# Altium schematic sheet Alarm_Clock_Schematic.SchDoc: Alarm Clock with Tempurature
size A; Engineer: Nathan Drzadinski; DocumentNumber: 1; Revision: 3; SheetNumber: 1; SheetTotal: 1
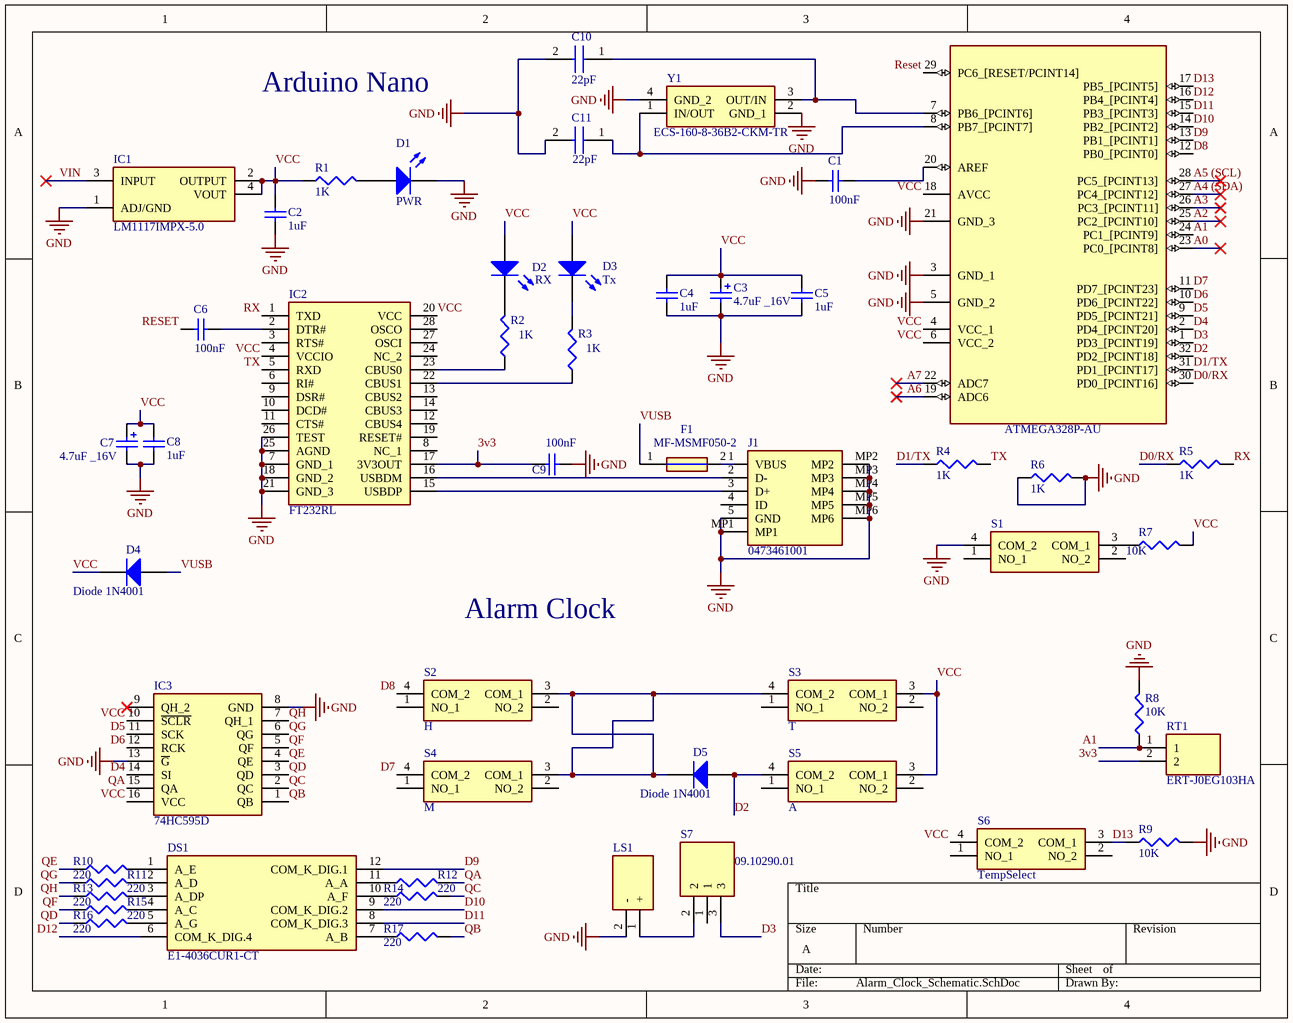
[diagram p0: Alarm_Clock_Schematic.SchDoc]

## Parts
?  ATMEGA328P-AU  [QFP80P900X900X120-32N]
C1  value 100nF  [C0805]  (hidden comment: Cap)
C2  value 1uF  [C0805]  (hidden comment: Cap)
C3  4.7uF _16V  [C1206]
C4  value 1uF  [C0805]  (hidden comment: Cap)
C5  value 1uF  [C0805]  (hidden comment: Cap)
C6  value 100nF  [C0805]  (hidden comment: Cap)
C7  4.7uF _16V  [C1206]
C8  value 1uF  [C0805]  (hidden comment: Cap)
C9  value 100nF  [C1206]
C10  22pF  [CAPC1608X97N]
C11  22pF  [CAPC1608X97N]
D1  PWR  [LED-1]
D2  RX  [LED-1]
D3  Tx  [LED-1]
D4  Diode 1N4001  [DO-41]
D5  Diode 1N4001  [DO-41]
DS1  E1-4036CUR1-CT  [DIPS1016W51P254L3000H745Q12N]
F1  MF-MSMF050-2  [FUSC4632X85N]
IC1  LM1117IMPX-5.0  [SOT230P700X180-4N]
IC2  FT232RL  [SOP65P778X200-28N]
IC3  74HC595D  [SOIC127P600X175-16N]
J1  0473461001  [0473461001]
LS1  (no value)  [25415210ROX]
R1  value 1K  [J1-0603]
R2  value 1K  [J1-0603]
R3  value 1K  [J1-0603]
R4  value 1K  [J1-0603]
R5  value 1K  [J1-0603]
R6  value 1K  [J1-0603]
R7  value 10K  [J1-0603]
R8  value 10K  [J1-0603]
R9  value 10K  [J1-0603]
R10  value 220  [J1-0603]
R11  value 220  [J1-0603]
R12  value 220  [J1-0603]
R13  value 220  [J1-0603]
R14  value 220  [J1-0603]
R15  value 220  [J1-0603]
R16  value 220  [J1-0603]
R17  value 220  [J1-0603]
RT1  ERT-J0EG103HA  [AXIAL-0.3]
S1  (no value)  [12411602]
S2  H  [12411602]
S3  T  [12411602]
S4  M  [12411602]
S5  A  [12411602]
S6  TempSelect  [12411602]
S7  09.10290.01  [091029001]
Y1  ECS-160-8-36B2-CKM-TR  [ECS160836B2CKMTR]

## Nets
GND: ?.3(GND_1) ?.5(GND_2) ?.21(GND_3) C1.1 C2.1 C3.2 C4.1 C5.1 C7.2 C8.1 C9.2 C10.2 C11.2 D1.2(K) IC1.1(ADJ/GND) IC2.7(GND_1) IC2.18(GND_2) IC2.21(GND_3) IC2.25(AGND) IC2.26(TEST) IC3.8(GND) IC3.13(~{G}) J1.5(GND) J1.MP1 J1.MP2 J1.MP3 J1.MP4 J1.MP5 J1.MP6 LS1.2(-) R6.1 R6.2 R8.2 R9.2 S1.4(COM_2) Y1.2(GND_1) Y1.4(GND_2)
3v3: C9.1 IC2.17(3V3OUT) RT1.2
A0: ?.23(PC0_[PCINT8])
A1: ?.24(PC1_[PCINT9]) R8.1 RT1.1
A2: ?.25(PC2_[PCINT10])
A3: ?.26(PC3_[PCINT11])
A4 (SDA): ?.27(PC4_[PCINT12])
A5 (SCL): ?.28(PC5_[PCINT13])
A6: ?.19(ADC6)
A7: ?.22(ADC7)
D0/RX: ?.30(PD0_[PCINT16]) R5.1
D1/TX: ?.31(PD1_[PCINT17]) R4.1
D2: ?.32(PD2_[PCINT18]) D5.1(A) S5.4(COM_2)
D3: ?.1(PD3_[PCINT19]) S7.3
D4: ?.2(PD4_[PCINT20]) IC3.14(SI)
D5: ?.9(PD5_[PCINT21]) IC3.11(SCK)
D6: ?.10(PD6_[PCINT22]) IC3.12(RCK)
D7: ?.11(PD7_[PCINT23]) S4.4(COM_2)
D8: ?.12(PB0_[PCINT0]) S2.4(COM_2)
D9: ?.13(PB1_[PCINT1]) DS1.12(COM_K_DIG.1)
D10: ?.14(PB2_[PCINT2]) DS1.9(COM_K_DIG.2)
D11: ?.15(PB3_[PCINT3]) DS1.8(COM_K_DIG.3)
D12: ?.16(PB4_[PCINT4]) DS1.6(COM_K_DIG.4)
D13: ?.17(PB5_[PCINT5]) R9.1 S6.3(COM_1)
QA: IC3.15(QA) R12.2
QB: IC3.1(QB) R17.2
QC: IC3.2(QC) R14.2
QD: IC3.3(QD) R16.1
QE: IC3.4(QE) R10.1
QF: IC3.5(QF) R15.1
QG: IC3.6(QG) R11.1
QH: IC3.7(QH_1) R13.1
Reset: ?.29(PC6_[RESET/PCINT14]) C6.1
RX: IC2.1(TXD) R5.2
TX: IC2.5(RXD) R4.2
VCC: ?.4(VCC_1) ?.6(VCC_2) ?.18(AVCC) C2.2 C3.1 C4.2 C5.2 C7.1 C8.2 D2.1(A) D3.1(A) D4.2(K) IC1.2(OUTPUT) IC1.4(VOUT) IC2.4(VCCIO) IC2.20(VCC) IC3.10(~{SCLR}) IC3.16(VCC) R1.1 R7.2 S3.3(COM_1) S5.3(COM_1) S6.4(COM_2)
VIN: IC1.3(INPUT)
VUSB: D4.1(A) F1.1
Net?_7: ?.7(PB6_[PCINT6]) C10.1 Y1.3(OUT/IN)
Net?_8: ?.8(PB7_[PCINT7]) C11.1 Y1.1(IN/OUT)
Net?_20: ?.20(AREF) C1.2
NetC6_2: C6.2 IC2.2(DTR#)
NetD1_1: D1.1(A) R1.2
NetD2_2: D2.2(K) R2.2
NetD3_2: D3.2(K) R3.2
NetD5_2: D5.2(K) S2.3(COM_1) S3.4(COM_2) S4.3(COM_1)
NetDS1_1: DS1.1(A_E) R10.2
NetDS1_2: DS1.2(A_D) R11.2
NetDS1_3: DS1.3(A_DP) R13.2
NetDS1_4: DS1.4(A_C) R15.2
NetDS1_5: DS1.5(A_G) R16.2
NetDS1_7: DS1.7(A_B) R17.1
NetDS1_10: DS1.10(A_F) R14.1
NetDS1_11: DS1.11(A_A) R12.1
NetF1_2: F1.2 J1.1(VBUS)
NetIC2_15: IC2.15(USBDP) J1.3(D+)
NetIC2_16: IC2.16(USBDM) J1.2(D-)
NetIC2_22: IC2.22(CBUS1) R3.1
NetIC2_23: IC2.23(CBUS0) R2.1
NetLS1_1: LS1.1(+) S7.2
NetR7_1: R7.1 S1.3(COM_1)

Not connected (* = marked no-connect by the designer): IC2 3(RTS#) 6(RI#) 8(NC_1) 9(DSR#) 10(DCD#) 11(CTS#) 12(CBUS4) 13(CBUS2) 14(CBUS3) 19(RESET#) 24(NC_2) 27(OSCI) 28(OSCO); IC3 9(QH_2)*; J1 4(ID); S1 1(NO_1) 2(NO_2); S2 1(NO_1) 2(NO_2); S3 1(NO_1) 2(NO_2); S4 1(NO_1) 2(NO_2); S5 1(NO_1) 2(NO_2); S6 1(NO_1) 2(NO_2); S7 1

## Notes on the sheet
- Arduino Nano
- Alarm Clock

## Library data of the parts
? = ATMEGA328P-AU: Integrated Circuit; Manufacturer_Name: Microchip; Datasheet Link: https://componentsearchengine.com/Datasheets/2/ATMEGA328P-AU.pdf; Height: 1.2mm; Manufacturer_Part_Number: ATMEGA328P-AU; Mouser Part Number: 556-ATMEGA328P-AU; Mouser Price/Stock: https://www.mouser.co.uk/ProductDetail/Microchip-Technology-Atmel/ATMEGA328P-AU?qs=K8BHR703ZXiCmmgp6%2FGNmQ%3D%3D; Arrow Part Number: ATMEGA328P-AU; Arrow Price/Stock: https://www.arrow.com/en/products/atmega328p-au/microchip-technology?region=nac
C1 C2 C4-C6 C8 = Cap: Capacitor; Published: 8-Jun-2000; LatestRevisionDate: 17-Jul-2002; LatestRevisionNote: Re-released for DXP Platform.; PackageReference: RAD-0.3; Publisher: Altium Limited; PackageDescription: Radial Cap, Thru-Hole; 2 Leads; 0.3 in Pin Spacing
C3 C7 = Cap Pol2: Polarized Capacitor (Axial); Published: 8-Jun-2000; LatestRevisionDate: 17-Jul-2002; LatestRevisionNote: Re-released for DXP Platform.; PackageReference: POLAR0.8; Publisher: Altium Limited; PackageDescription: Polarized Capacitor; 2 Leads
C9 = Cap Semi: Capacitor (Semiconductor SIM Model); Published: 8-Jun-2000; LatestRevisionDate: 29-May-2009; LatestRevisionNote: IPC-7351 Footprint Added.; PackageReference: C1206; Publisher: Altium Limited; PackageDescription: Chip Capacitor
C10 C11 = VJ0603A220JXBAC: Capacitor; Manufacturer_Name: Vishay; Datasheet Link: http://www.vishay.com/docs/45226/vj31xrohsautomlcc.pdf; Height: 0.97mm; Manufacturer_Part_Number: VJ0603A220JXBAC; Mouser Part Number: 77-VJ0603A220JXBAC; Mouser Price/Stock: https://www.mouser.co.uk/ProductDetail/Vishay-Vitramon/VJ0603A220JXBAC/?qs=cPJiB9SLnv4cPK1%252B20z21w%3D%3D
D1 = LED1: Typical Blue GaAs LED; Published: 8-Jun-2000; LatestRevisionDate: 08-Jul-2005; LatestRevisionNote: Mech Layer 1 removed.; PackageReference: LED-1; Publisher: Altium Limited; PackageDescription: LED; 2 Leads
D2 = LED1: Typical RED GaAs LED; Published: 8-Jun-2000; LatestRevisionDate: 08-Jul-2005; LatestRevisionNote: Mech Layer 1 removed.; PackageReference: LED-1; Publisher: Altium Limited; PackageDescription: LED; 2 Leads
D3 = LED1: Typical Green GaAs LED; Published: 8-Jun-2000; LatestRevisionDate: 08-Jul-2005; LatestRevisionNote: Mech Layer 1 removed.; PackageReference: LED-1; Publisher: Altium Limited; PackageDescription: LED; 2 Leads
D4 D5 = Diode 1N4001: 1 Amp General Purpose Rectifier; Published: 8-Jun-2000; LatestRevisionDate: 17-Jul-2002; LatestRevisionNote: Re-released for DXP Platform.; DatasheetVersion: 1998; PackageVersion: Aug-1999; PackageReference: DO-41; Publisher: Altium Limited; PackageDescription: Diode, Axial; Body 5.2 x 2.7 mm (LxDia. max), Lead Dia. 0.86 mm (max); Code_JEDEC: DO-204-AL; ComponentLink1Description: Manufacturer Link; ComponentLink1URL: http://www.fairchildsemi.com/; ComponentLink2Description: Datasheet; ComponentLink2URL: http://www.fairchildsemi.com/ds/1N%2F1N4001.pdf
DS1 = E1-4036CUR1-CT: Display; Manufacturer_Name: STRONG BASED; Datasheet Link: https://cdn.ozdisan.com/ETicaret_Dosya/383272_1248365.pdf; Height: 7.45mm; Manufacturer_Part_Number: E1-4036CUR1-CT
F1 = MF-MSMF050-2: Fuse; Manufacturer_Name: Bourns; Datasheet Link: https://www.bourns.com/pdfs/mfmsmf.pdf; Height: 0.85mm; Manufacturer_Part_Number: MF-MSMF050-2; Mouser Part Number: 652-MF-MSMF050-2; Mouser Price/Stock: https://www.mouser.co.uk/ProductDetail/Bourns/MF-MSMF050-2?qs=t3shhpq1i1DZ7OBD5kLNoA%3D%3D; Arrow Part Number: MF-MSMF050-2; Arrow Price/Stock: https://www.arrow.com/en/products/mf-msmf050-2/bourns?region=nac
IC1 = LM1117IMPX-5.0: Integrated Circuit; Manufacturer_Name: Texas Instruments; Datasheet Link: https://www.ti.com.cn/cn/lit/ds/symlink/lm1117.pdf?ts=1616831265067&ref_url=https%253A%252F%252Fwww.ti.com.cn%252Fproduct%252Fcn%252FLM1117; Height: 1.8mm; Manufacturer_Part_Number: LM1117IMPX-5.0; Mouser Part Number: 926-LM1117IMPX-50; Mouser Price/Stock: https://www.mouser.co.uk/ProductDetail/Texas-Instruments/LM1117IMPX-50?qs=X1J7HmVL2ZEsJC9W8GAV9A%3D%3D
IC2 = FT232RL: Integrated Circuit; Manufacturer_Name: FTDI Chip; Datasheet Link: http://www.ftdichip.com/Support/Documents/DataSheets/ICs/DS_FT232R.pdf; Height: 2mm; Manufacturer_Part_Number: FT232RL; Arrow Part Number: FT232RL; Arrow Price/Stock: https://www.arrow.com/en/products/ft232rl/ftdi-chip
IC3 = 74HC595D: Integrated Circuit; Manufacturer_Name: Toshiba; Datasheet Link: https://toshiba.semicon-storage.com/info/docget.jsp?did=36768&prodName=74HC595D; Height: 1.75mm; Manufacturer_Part_Number: 74HC595D; Mouser Part Number: N/A; Mouser Price/Stock: https://www.mouser.co.uk/ProductDetail/Toshiba/74HC595D?qs=7EBvPakHacViJoQmXKcnew%3D%3D; Arrow Part Number: 74HC595D; Arrow Price/Stock: https://www.arrow.com/en/products/74hc595d/toshiba?region=nac
J1 = 0473461001: Connector; Manufacturer_Name: Molex; Datasheet Link: https://componentsearchengine.com/Datasheets/1/0473461001.pdf; Height: 2.45mm; Manufacturer_Part_Number: 0473461001; Mouser Part Number: N/A; Mouser Price/Stock: https://www.mouser.com/Search/Refine.aspx?Keyword=N%2FA; Arrow Part Number: 0473461001; Arrow Price/Stock: https://www.arrow.com/en/products/0473461001/molex?region=nac
LS1 = 254-15210-ROX: Loudspeaker or Buzzer; Manufacturer_Name: Kobitone; Datasheet Link: https://www.mouser.de/datasheet/2/209/KT-400269-1172018.pdf; Height: 8.51mm; Manufacturer_Part_Number: 254-15210-ROX; Mouser Part Number: 254-15210-ROX; Mouser Price/Stock: https://www.mouser.co.uk/ProductDetail/Kobitone/254-15210-ROX?qs=05UEgX2TgG1gFl%2FaATOCEw%3D%3D
R1-R17 = Res3: Resistor; Published: 8-Jun-2000; LatestRevisionDate: 29-May-2009; LatestRevisionNote: IPC-7351 Footprint Added.; PackageReference: J1-0603; Publisher: Altium Limited; PackageDescription: Chip Resistor
RT1 = ERT-J0EG103HA: Thermistor; Manufacturer_Name: Panasonic; Datasheet Link: https://datasheet.datasheetarchive.com/originals/distributors/Datasheets-DGA6/548517.pdf; Height: 0.55mm; Manufacturer_Part_Number: ERT-J0EG103HA; Mouser Part Number: 667-ERT-J0EG103HA; Mouser Price/Stock: https://www.mouser.com/Search/Refine.aspx?Keyword=667-ERT-J0EG103HA; Arrow Part Number: ERT-J0EG103HA; Arrow Price/Stock: https://www.arrow.com/en/products/ert-j0eg103ha/panasonic
S1-S6 = 1241.1602: Switch; Manufacturer_Name: SCHURTER; Datasheet Link: https://www.schurter.com/en/datasheet/PMS; Height: 4.55mm; Manufacturer_Part_Number: 1241.1602; Mouser Part Number: 693-1241.1602; Mouser Price/Stock: https://www.mouser.co.uk/ProductDetail/Schurter/12411602?qs=JHn%2F0Af%2Fl5EgRnV0HUH1SQ%3D%3D
S7 = 09.10290.01: Switch; Manufacturer_Name: EOZ; Datasheet Link: http://uk.rs-online.com/web/p/products/2047871; Height: 2.5mm; Manufacturer_Part_Number: 09.10290.01
Y1 = ECS-160-8-36B2-CKM-TR: Crystal or Oscillator; Manufacturer_Name: ECS; Datasheet Link: https://www.mouser.fr/datasheet/2/122/ECX_2236B2-2400583.pdf; Height: 0.6mm; Manufacturer_Part_Number: ECS-160-8-36B2-CKM-TR; Mouser Part Number: 520-160-8-36B2-CKMTR; Mouser Price/Stock: https://www.mouser.co.uk/ProductDetail/ECS/ECS-160-8-36B2-CKM-TR?qs=QNEnbhJQKvaIQPndV3OLHg%3D%3D